# EAGLE design 0128-pos-neg-boost (EAGLE 9.6.2)
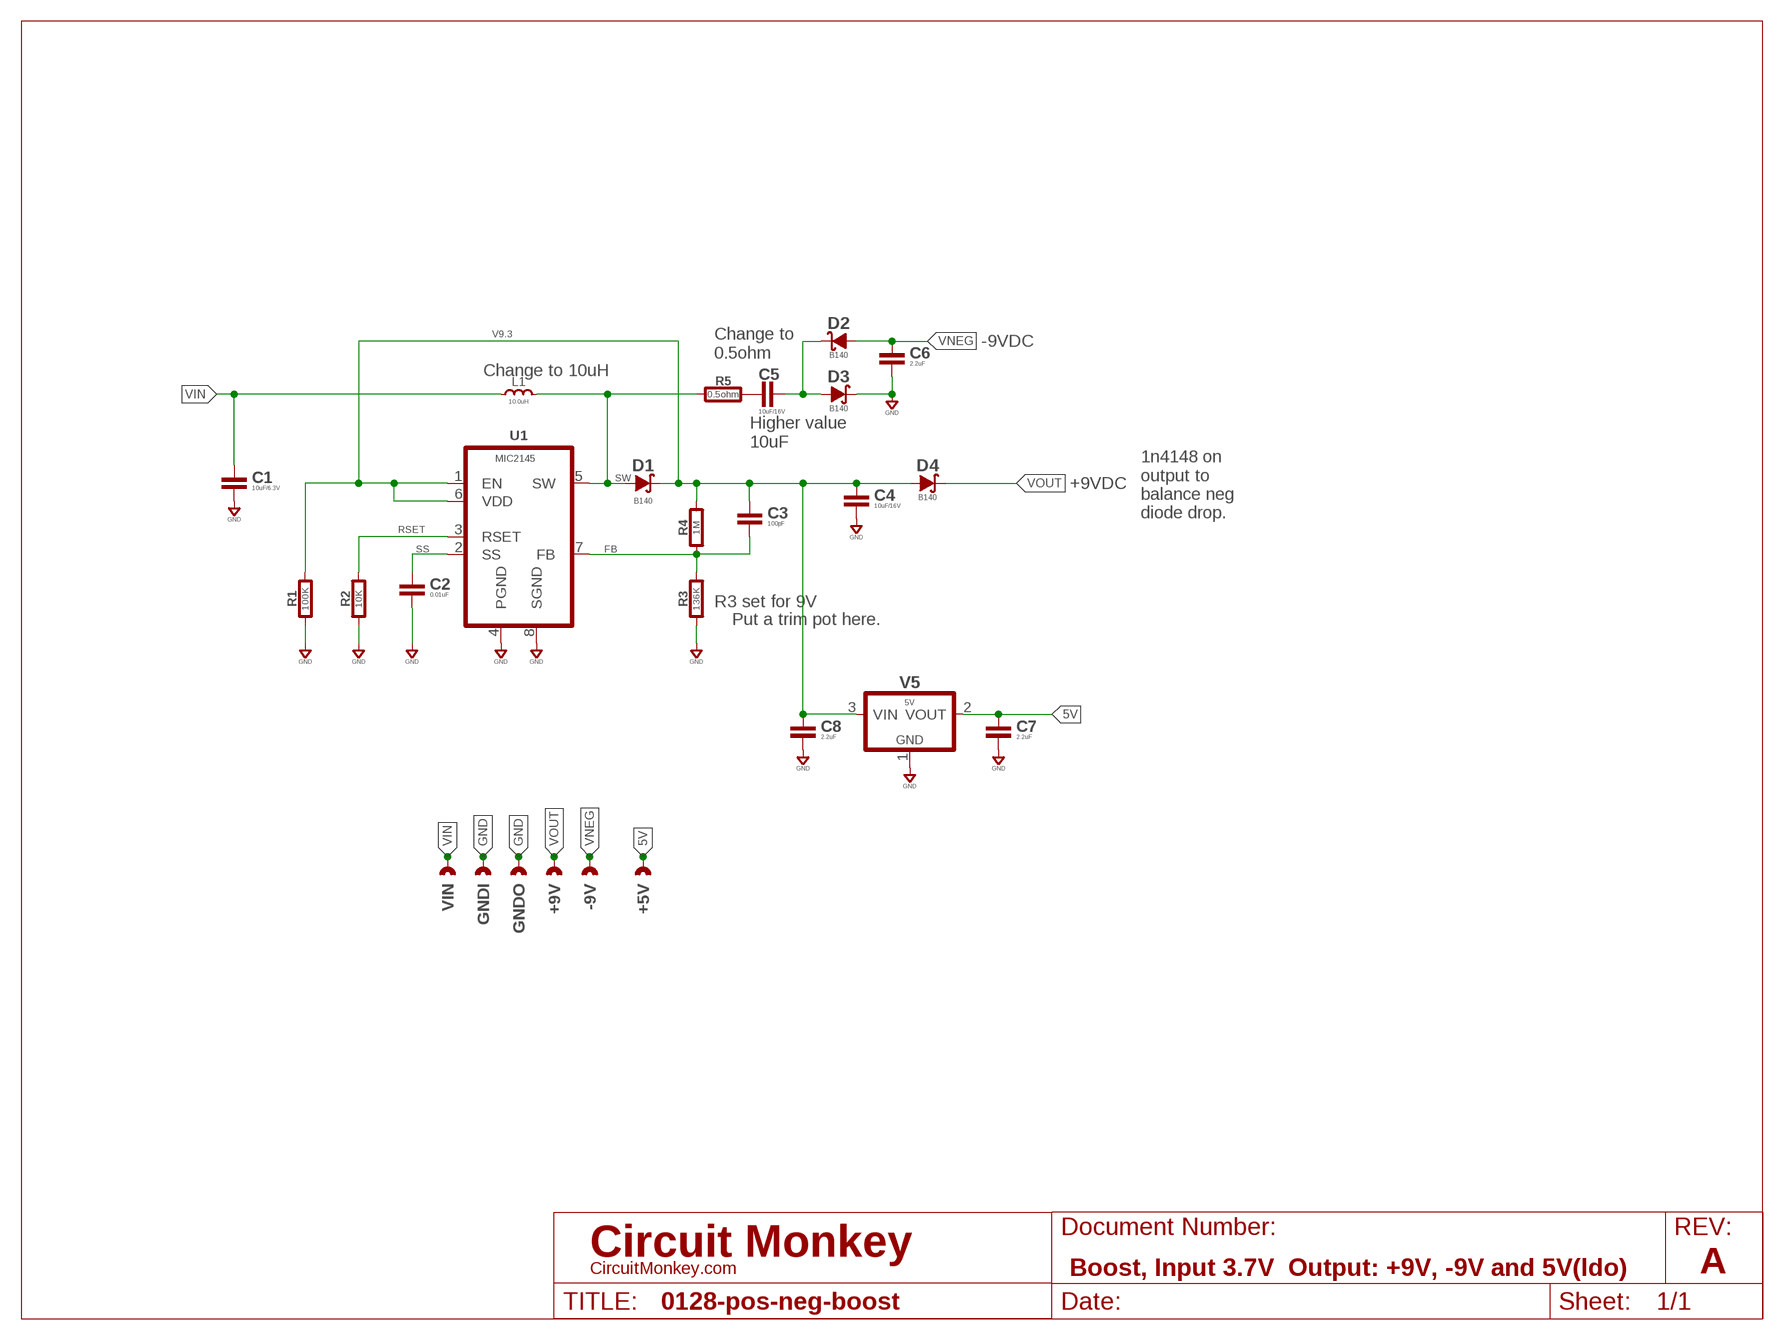
[diagram p0: schematic, sheet 1]
SHEET1 (LETTER_L-CIRCUITMONKEY): DOCUMENT_NUMBER: Boost, Input 3.7V Output: +9V, -9V and 5V(ldo); REV: A

## Parts
+5V  CAST-01X12.00MM  [CAST01-2.00MM]
+9V  CAST-01X12.00MM  [CAST01-2.00MM]
-9V  CAST-01X12.00MM  [CAST01-2.00MM]
C1  10uF/6.3V  CAPACITOR0603  [0603-CAP]
C2  0.01uF  CAPACITOR0603  [0603-CAP]
C3  100pF  CAPACITOR0603  [0603-CAP]
C4  10uF/16V  CAPACITOR0603  [0603-CAP]
C5  10uF/16V  CAPACITOR0603  [0603-CAP]
C6  2.2uF  CAPACITOR0603  [0603-CAP]
C7  2.2uF  CAPACITOR0603  [0603-CAP]
C8  2.2uF  CAPACITOR0603  [0603-CAP]
D1  B140  SCHOTTKYB140  [SMA]
D2  B140  SCHOTTKYB140  [SMA]
D3  B140  SCHOTTKYB140  [SMA]
D4  B140  SCHOTTKYB140  [SMA]
GNDI  CAST-01X12.00MM  [CAST01-2.00MM]
GNDO  CAST-01X12.00MM  [CAST01-2.00MM]
L1  10.0uH  INDUCTORSMD-05X04MM  [IND-SRN5040]
R1  100K  RESISTOR0603  [0603-RES]
R2  10K  RESISTOR0603  [0603-RES]
R3  136K  RESISTOR0603  [0603-RES]
R4  1M  RESISTOR0603  [0603-RES]
R5  0.5ohm  RESISTOR0603  [0603-RES]
U1  MIC2145  BOOST-MIC2145-MSOP  [MSOP8-0.65]
V5  5V  LDO-3P--5V-SOT23  [SOT-23]
VIN  CAST-01X12.00MM  [CAST01-2.00MM]

## Nets
5V: +5V.1 +5V.P$1 +5V.P$2 C7.1 V5.2(VOUT)
FB: C3.2 R3.2 R4.1 U1.7(FB)
GND: C1.2 C2.2 C4.2 C6.2 C7.2 C8.2 D3.K GNDI.1 GNDI.P$1 GNDI.P$2 GNDO.1 GNDO.P$1 GNDO.P$2 R1.1 R2.1 R3.1 U1.4(PGND) U1.8(SGND) V5.1(GND)
N$1: C5.1 R5.2
N$2: C5.2 D2.K D3.A
RSET: R2.2 U1.3(RSET)
SS: C2.1 U1.2(SS)
SW: D1.A L1.1 R5.1 U1.5(SW)
V9.3: C3.1 C4.1 C8.1 D1.K D4.A R1.2 R4.2 U1.1(EN) U1.6(VDD) V5.3(VIN)
VIN: C1.1 L1.2 VIN.1 VIN.P$1 VIN.P$2
VNEG: -9V.1 -9V.P$1 -9V.P$2 C6.1 D2.A
VOUT: +9V.1 +9V.P$1 +9V.P$2 D4.K

## Notes on the sheet
- -9VDC
- Change to
  0.5ohm
- Change to 10uH
- Higher value
  10uF
- +9VDC
- 1n4148 on
  output to
  balance neg
  diode drop.
- R3 set for 9V
- Put a trim pot here.

## Library data of the parts
+5V +9V -9V GNDI GNDO VIN = con-headers:CAST-01X1: Castelated Edge Hole Pad
C1-C8 = rlc:CAPACITOR: Capacitor; COST01: 0.12; COST10: 0.09; COST100: 0.05
D1-D4 = diodes:SCHOTTKY: Schottky Diodes; COST01: 0.38; COST10: 0.28; COST100: 0.18; MFR: Vishay/Various; MPN: B140
L1 = rlc:INDUCTOR: Inductor; MFR: Bourns; MPN: SRN5040
R1-R5 = rlc:RESISTOR: Resistor; COST01: 0.10; COST10: 0.05; COST100: 0.02
U1 = regulators:BOOST-MIC2145: Micrel 2145 Boost Converter; COST01: 2.75; COST10: 2.71; COST100: 2.70; MFR: Micrel; MPN: MIC2145YMM
V5 = regulators:LDO-3P-: regulator 3-pin; COST01: 0.66; COST10: 0.56; COST100: 0.39; MFR: Diodes, Inc.; MPN: AP7387-50SA

## Board
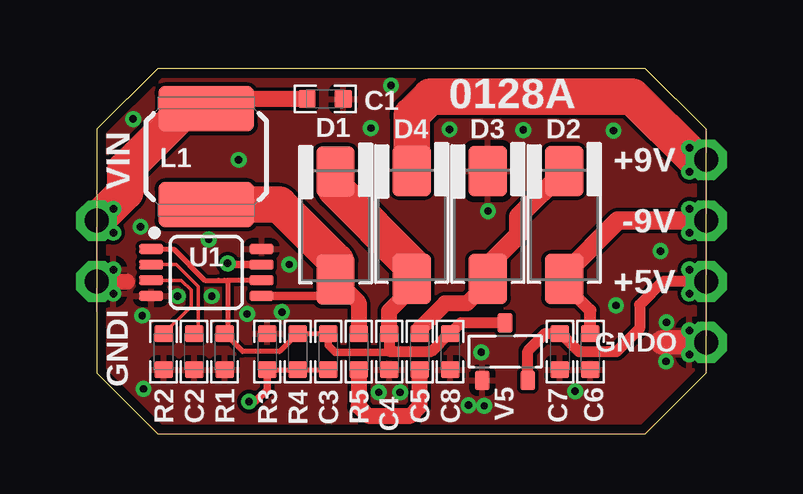
[diagram p1: board, top side]
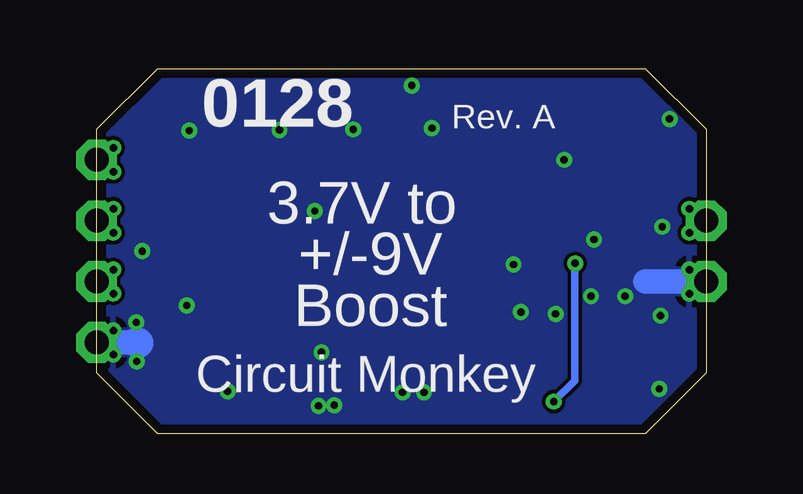
[diagram p2: board, bottom side, seen from below]

Size 25.4 x 15.24 mm. Coordinates in mm from the lower left corner, seen from the top.
Outline: 2.54,0 22.86,0 25.4,2.54 25.4,12.7 22.86,15.24 2.54,15.24 0,12.7 0,2.54 2.54,0
Copper layers (1*16): Top 0.0356mm / dielectric 1.5011mm / Bottom 0.0356mm
Design rules "OSH-CircuitMonkey *": minimum track width 6mil, minimum drill 12mil, track to track 6mil, track to pad 6mil, pad to pad 6mil, via to via 6mil, smd to smd 6mil, copper to edge 15mil, drill to drill 6mil, minimum pad ring 7mil, minimum via ring 7mil, stop-mask expansion 3mil, vias tented up to drill 13mil, thermal gap 10mil

### Footprints (pad centres in the part's own frame; a part is rotated, then mirrored left to right if it is on the bottom)
CAST01-2.00MM = drill 1 pad 1.7 octagon: 1 0,0 | drill 0.305: P$1 -0.7,0.5; P$2 -0.7,-0.5
0603-CAP = smd 0.711 x 0.762: 1 -0.752,0; 2 0.752,0
SMA = smd 2.1 x 1.6: A -2.25,0; K 2.25,0
IND-SRN5040 = smd 1.9 x 4: 1 -2,0; 2 2,0
0603-RES = smd 0.711 x 0.762: 1 -0.752,0; 2 0.752,0
MSOP8-0.65 = smd 1 x 0.4: 1 -2.3,0.975; 2 -2.3,0.325; 3 -2.3,-0.325; 4 -2.3,-0.975; 5 2.3,-0.975; 6 2.3,-0.325; 7 2.3,0.325; 8 2.3,0.975
SOT-23 = smd 0.6 x 0.8: 1 0.95,1.2; 2 -0.95,1.2; 3 0,-1.2

### Placement (x,y rotation side)
+5V  25.4,6.35 0 top
+9V  25.4,11.43 0 top
-9V  25.4,8.89 0 top
C1  9.53,13.97 0 top
C2  4.06,3.43 270 top
C3  9.65,3.43 270 top
C4  12.19,3.43 270 top
C5  13.46,3.43 90 top
C6  20.57,3.43 270 top
C7  19.3,3.43 270 top
C8  14.73,3.43 270 top
D1  9.96,8.69 90 top
D2  19.48,8.71 90 top
D3  16.31,8.71 90 top
D4  13.13,8.71 90 top
GNDI  0,6.35 180 top
GNDO  25.4,3.81 0 top
L1  4.57,11.56 90 top
R1  5.33,3.43 90 top
R2  2.79,3.43 90 top
R3  7.11,3.43 270 top
R4  8.38,3.43 90 top
R5  10.92,3.43 270 top
U1  4.57,6.73 0 top
V5  17.02,3.43 180 top
VIN  0,8.89 180 top

### Tracks (layer width: path | path; a pad name or v marks a point on that pad's centre or on a via)
5V
  Top 0.254: +5V.P$1 24.9,6.85 +5V.1 24.9,5.85 +5V.P$2
  Top 0.457: V5.2 17.97,3.45 18.69,4.18 C7.1 19.34,4.18 20.09,3.43 21.67,3.43 22.63,4.39 22.63,5.38 23.6,6.35 +5V.1
FB  (via drill 0.3)
  Top 0.203: R3.2 R4.1 C3.2
  Top 0.305: U1.7 5.52,7.06 v5.46,7.11 | v6.35,1.35 6.62,1.35 7.11,1.84 R3.2
  Bottom 0.305: v5.46,7.11 5.49,7.09 5.49,2.21 v6.35,1.35
GND  (via drill 0.3)
  Top 0.254: GNDO.P$1 24.9,4.31 GNDO.1 24.9,3.31 GNDO.P$2
  Top 0.66: GNDI.1 1.27,6.35
  Top 1.016: GNDO.1 23.57,3.81
  Bottom 0.254: GNDI.P$2 0.2,6.35 GNDI.1 0.5,5.85 GNDI.P$1
  Bottom 1.016: GNDI.1 2.54,6.35 | GNDO.1 23.7,3.81
  Bottom 1.27: 23.7,3.81 23.67,3.79
  other vias: 11.76,1.73 12.65,1.73 15.49,1.19 16.15,1.17 16.03,3.4 23.5,7.62 21.64,5.36 23.72,3.02 23.75,4.65 16.31,9.3 17.78,12.67 14.71,12.7 11.43,12.75 12.27,14.53 21.54,12.65 19.94,1.78 1.96,1.88 1.91,4.93 5.92,11.43 1.52,13.13 6.27,5 7.72,5.08 8.03,7.06 4.8,5.74 4.67,8.1 1.83,8.64 3.38,5.74
  pour Top (rank 5): 0,0 0,15.24 25.4,15.24 25.4,0
  pour Bottom (rank 5): 0,0 0,15.24 25.4,15.24 25.4,0
N$1
  Top 0.66: R5.2 10.92,1.14 11.3,0.76 13.08,0.76 13.46,1.14 C5.1
N$2
  Top 0.66: C5.2 13.46,4.38 14.52,5.45 15.44,5.45 16.31,6.31 D3.A
  Top 0.762: D3.A 16.31,7.03 17.58,8.29 17.58,9.06 D2.K
RSET
  Top 0.152: R2.2 2.81,4.18 3.94,5.31 3.94,5.99 3.52,6.41 U1.3
SS
  Top 0.152: U1.2 3.33,7.06 4.24,6.15 4.24,4.36 C2.1
SW
  Top 0.356: U1.5 9.28,5.76 D1.A
  Top 0.66: D1.A 10.92,5.47 R5.1
  Top 1.524: D1.A 9.96,7.2 7.6,9.56 L1.1
V9.3
  Top 0.203: 5.46,6.41 5.46,4.31 R1.2 6.09,3.43 7.63,3.43 R4.2 C3.1 | U1.1 3.22,7.71 4.52,6.41 5.08,6.41 5.33,6.41 5.46,6.41 | U1.6 5.46,6.41
  Top 0.305: C4.1 12.19,3.39 9.95,3.39 9.65,3.69 C3.1
  Top 0.457: C4.1 12.19,3.44 13.96,3.44 14.7,4.18 C8.1 15.18,4.63 V5.3
  Top 0.66: C4.1 12.19,5.13 13.13,6.07 D4.A
  Top 1.524: D1.K 9.96,10.2 13.13,7.03 D4.A
VIN
  Top 0.66: L1.2 4.99,13.97 C1.1
  Top 1.524: VIN.1 1.19,10.08 1.19,11.02 3.73,13.56 L1.2
  Bottom 0.254: VIN.P$2 0.5,9.39 VIN.1 0.5,8.39 VIN.P$1
VNEG
  Top 0.254: -9V.P$1 24.9,9.39 -9V.1 24.9,8.39 -9V.P$2
  Top 0.508: C6.1 20.57,5.16 19.48,6.25 D2.A
  Top 0.762: D2.A 19.48,6.66 21.72,8.89 -9V.1
VOUT
  Top 0.254: +9V.P$1 24.9,11.93 +9V.1 24.9,10.93 +9V.P$2
  Top 1.524: D4.K 13.13,13.29 13.91,14.07 22.33,14.07 24.94,11.46 25.38,11.46 +9V.1

### Text on the board
tPlace: 0128A
bPlace: 0128 | Rev. A | 3.7V to / +/-9V / Boost | Circuit Monkey